# EAGLE design H03R00 (EAGLE 9.3.0)
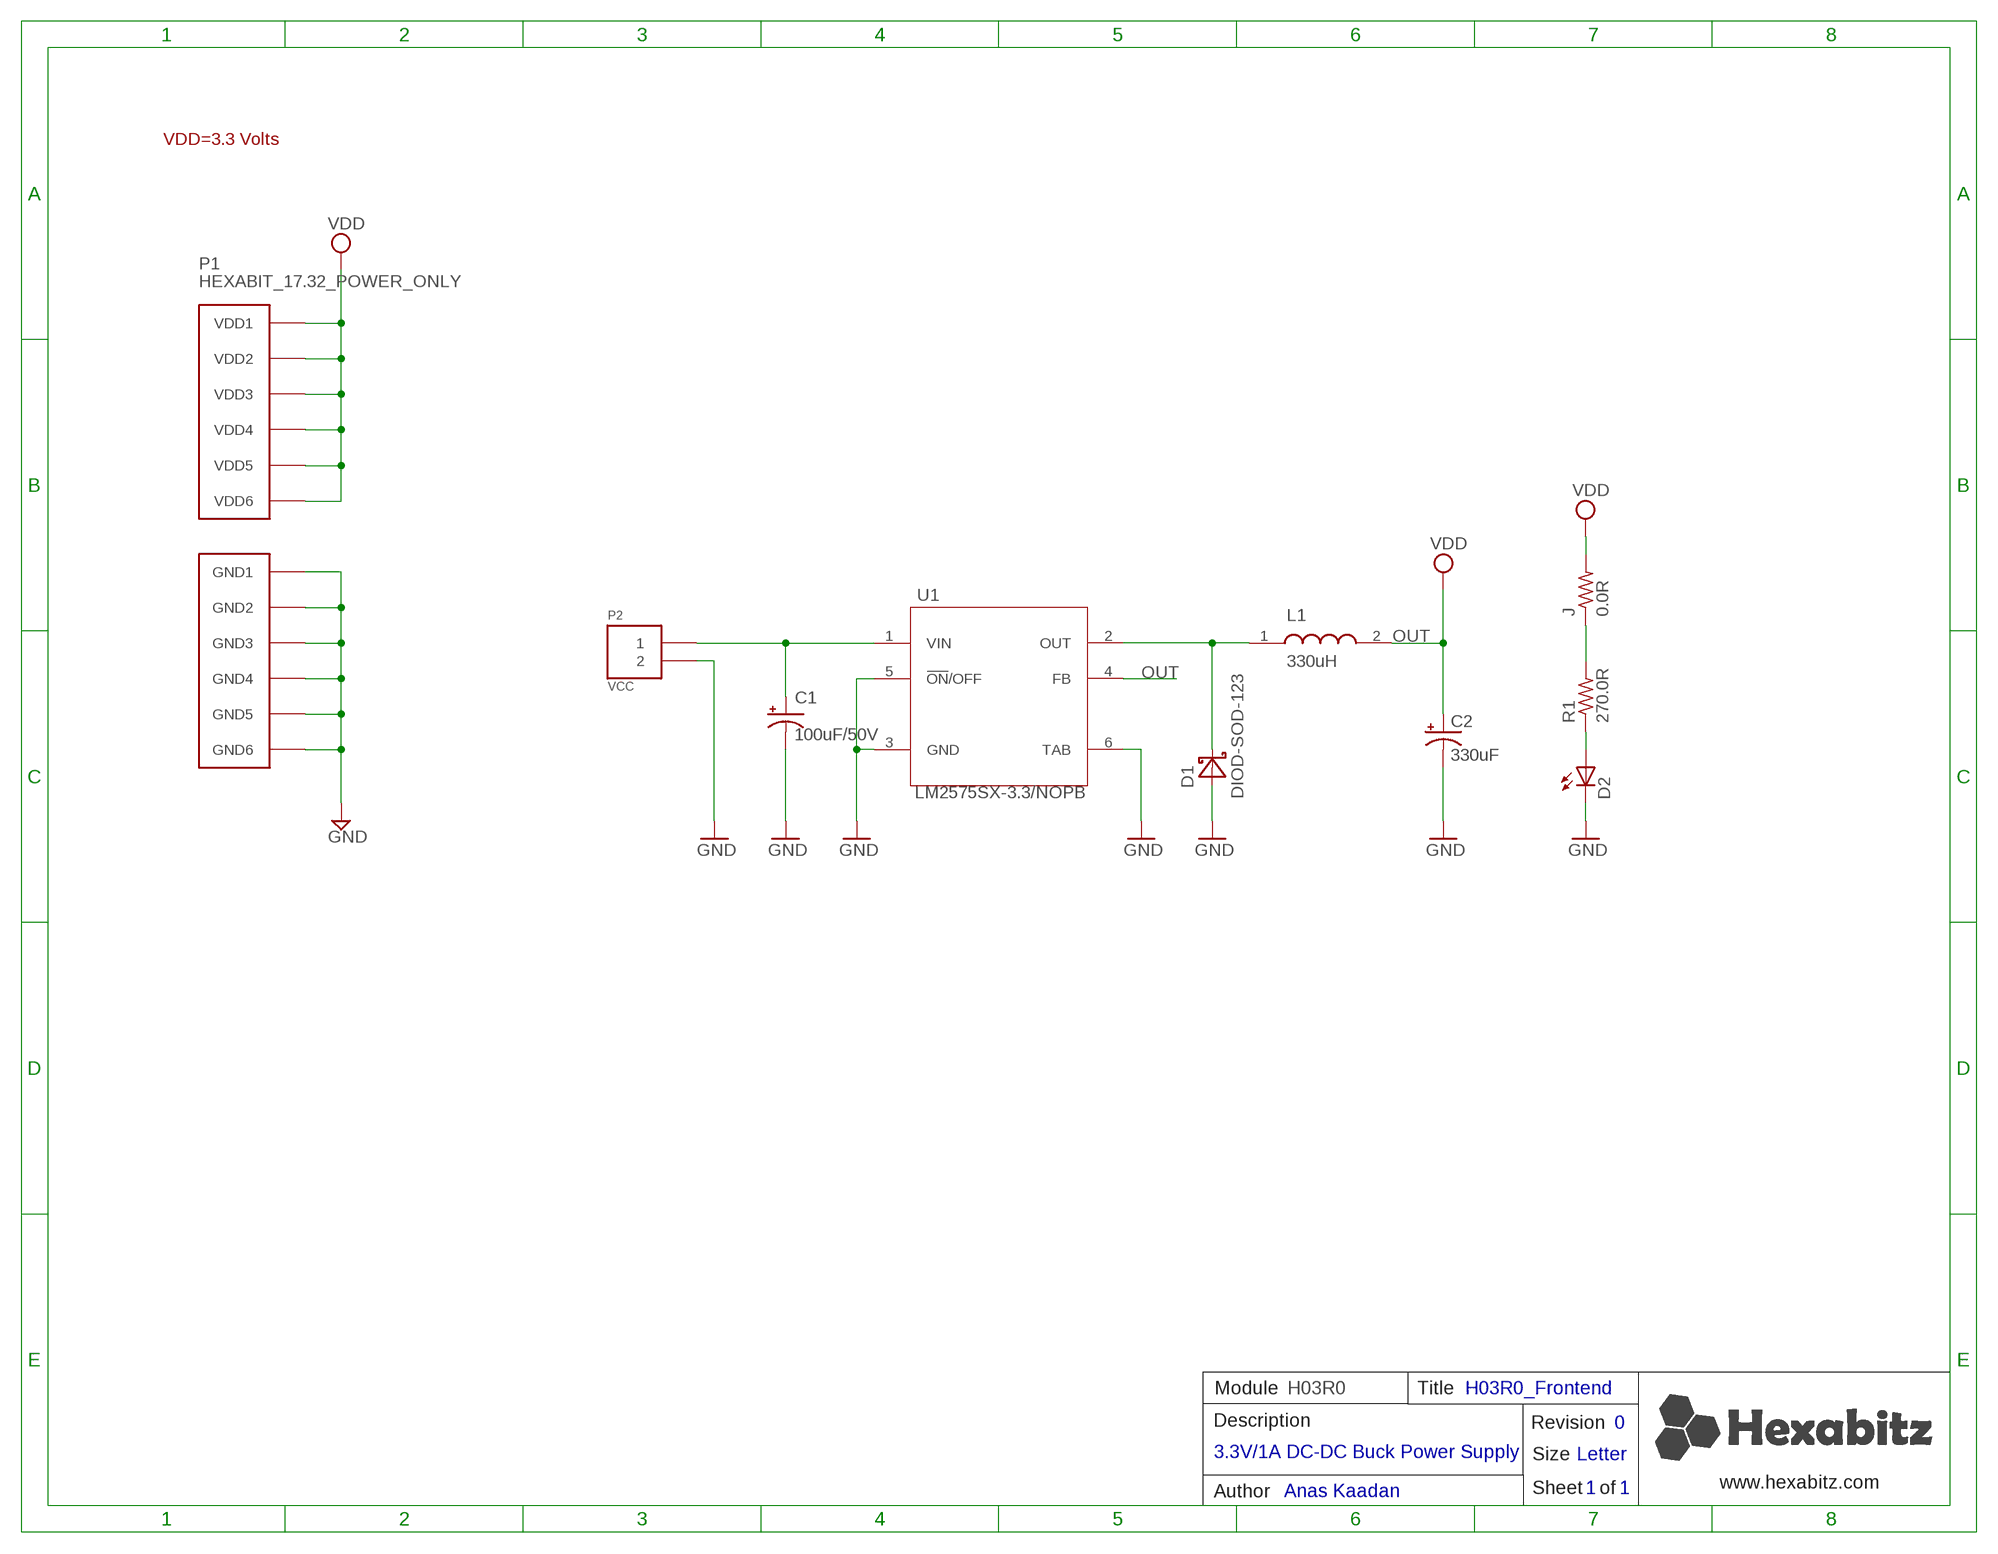
[diagram p0: schematic, sheet 1]

## Parts
C1  100uF/50V  CPOL-US  [E3,5-8]
C2  330uF  AVX-E  [CAPPM7343X200N]
D1  DIOD-SOD-123  [SOD123]
D2  VLMS1300-GS08  [VLMS1300-GS08]
J  0.0R  R-0603  [R-0603]
L1  330uH  SRR1280-331K  [SRR1280-150M]
P1  HEXABIT_17.32_POWER_ONLY  [HEXABIT_17.32_POWER_ONLY]
P2  VCC  1546111-2  [1546111-2]
R1  270.0R  R-0603  [R-0603]
U1  LM2575SX-3.3/NOPB  [TO170P1435X457-6N]

## Nets
GND: C1.- C2.2(-) D1.1(A) D2.C P1.PAD_PD7(GND1) P1.PAD_PD8(GND2) P1.PAD_PD9(GND3) P1.PAD_PD10(GND4) P1.PAD_PD11(GND5) P1.PAD_PD12(GND6) P2.2 U1.3(GND) U1.5(ON/OFF) U1.6(TAB)
N$1: C1.+ P2.1 U1.1(VIN)
N$2: D1.2(C) L1.1 U1.2(OUT)
N$3: D2.A R1.1
N$4: J.1 R1.2
OUT: C2.1(+) L1.2 U1.4(FB) ; supply symbol labelled VDD
VDD: J.2 P1.PAD_PU7(VDD1) P1.PAD_PU8(VDD2) P1.PAD_PU9(VDD3) P1.PAD_PU10(VDD4) P1.PAD_PU11(VDD5) P1.PAD_PU12(VDD6)

## Notes on the sheet
- VDD=3.3 Volts
- Module | H03R0 | Title | H03R0_Frontend
- Description | Revision | 0
- 3.3V/1A DC-DC Buck Power Supply | Size | Letter
- www.hexabitz.com
- Author | Anas Kaadan | Sheet   of | 1 | 1
- C:/Users/Admin/Desktop/logodraft.bmp | C:/Users/Admin/Desktop/logodraft.bmp

## Library data of the parts
C1 = Hexabitz:CPOL-US: ELECTROLYTIC CAPACITOR grid 3.5 mm, diameter 8 mm; CAPACITANCE: 100F; CPACITANCE_RATING: ±20%; MFN: Nichicon; MPN: UVR1H101MPD1TD; OCTOPART_ID: 913e58b97f3b4ef9; OCTOPART_URL: http://octopart.com/uvr1h101mpd1td-nichicon-9292643; VOLTAGE_RATING_DC: 50.0 V
C2 = Hexabitz:AVX-E: Panasonic 330F SMD Solid Polymer Tantalum Capacitor, 6.3 V 20%, POSCAP Series Source: Datasheet <https://industrial.panasonic.com/cdbs/www-data/pdf/AAA8000/AAA8000C68.pdf>; DESCRIPTION: Panasonic 330F SMD Solid Polymer Tantalum Capacitor, 6.3 V 20%, POSCAP Series; HEIGHT: 2mm; MANUFACTURER_NAME: Panasonic; MANUFACTURER_PART_NUMBER: 6TPC330MA; MOUSER_PART_NUMBER: 667-6TPC330MA; MOUSER_PRICE-STOCK: https://www.mouser.com/Search/Refine.aspx?Keyword=667-6TPC330MA; RS_PART_NUMBER: 1666900; RS_PRICE-STOCK: http://uk.rs-online.com/web/p/products/1666900
D1 = Hexabitz:DIOD-SOD-123: 1.0 A Surface Mount Schottky Barrier Rectifier, 40 V, -65 to 125 degC, 2-Pin SOD-123 Package, RoHS, Tape and Reel; CAPACITANCE: 1.1e-10 F; CURRENT_RATING: 1.0 A; MFN: diodes; MPN: 1N5819HW-7-F; OCTOPART_ID: e83e2130232537f9; OCTOPART_URL: https://octopart.com/1n5819hw-7-f-diodes+inc.-323197; VOLTAGE_RATING_DC: 40.0 V
D2 = Hexabitz:VLMS1300-GS08: Red 0603 130° Clear 54 mcd 2 V Surface Mount ChipLED ; Octopart Url : http://octopart.com/vlms1300-gs08-vishay-21709201; MFN: Vishay; MPN: VLMTG1300-GS08; OCTOPART_URL: http://octopart.com/vlmtg1300-gs08-vishay-21709202
J = Hexabitz:R-0603: Thick Film Resistors - SMD 0603; MFN: Yageo; MPN: RC0603JR-070RL; OCTOPART_URL: https://octopart.com/crcw06030000z0eahp-vishay-44320230; RESISTANCE: 0.0 Ω
L1 = Hexabitz:SRR1280-331K: Bourns SRR1280 Series Shielded Wire-wound SMD Inductor with a Ferrite Core, 330 H 10% Wire-Wound 1.1A Idc Q:18 Source: Datasheet <https://www.bourns.com/docs/Product-Datasheets/SRR1280.pdf>; ALLIED_NUMBER: 70277079; ALLIED_PRICE-STOCK: https://www.alliedelec.com/bourns-srr1280-331k/70277079/; DESCRIPTION: Bourns SRR1280 Series Shielded Wire-wound SMD Inductor with a Ferrite Core, 330 H 10% Wire-Wound 1.1A Idc Q:18; HEIGHT: mm; MANUFACTURER_NAME: Bourns; MANUFACTURER_PART_NUMBER: SRR1280-331K; MOUSER_PART_NUMBER: 652-SRR1280-331K; MOUSER_PRICE-STOCK: https://www.mouser.com/Search/Refine.aspx?Keyword=652-SRR1280-331K; RS_PART_NUMBER: 1728540; RS_PRICE-STOCK: http://uk.rs-online.com/web/p/products/1728540
P1 = hexabitz_connectors:HEXABIT_?_POWER_ONLY: Hexabitz Hexagon Module Connector Hexagon side length = 17.32mm. Power-only connector. All array ports are removed.
P2 = Hexabitz:1546111-2: Conn Shrouded Header HDR 2 POS 5.08mm Solder ST Thru-Hole; MFN: TE Connectivity; MPN: 1546111-2; OCTOPART_URL: https://octopart.com/1546111-2-te+connectivity-40393355
R1 = Hexabitz:R-0603: Thick Film Resistors - SMD 0603; MFN: Yageo; MPN: RC0603FR-07270RL; OCTOPART_URL: https://octopart.com/crcw0603270rjnea-vishay-39784736; RESISTANCE: 270.0 Ω; TOLERANCE: ±5%
U1 = Hexabitz:LM2575SX-3.3/NOPB: Step-Down Voltage Regulator; DESCRIPTION: Conv DC-DC 4V to 40V Step Down Single-Out 3.3V 1A 6-Pin_5+Tab_ TO-263 T/R; DIGI-KEY_PART_NUMBER: LM2575SX-3.3/NOPBCT-ND; DIGI-KEY_PURCHASE_URL: https://www.digikey.com/product-detail/en/texas-instruments/LM2575SX-3.3-NOPB/LM2575SX-3.3-NOPBCT-ND/3526855?utm_source=snapeda&utm_medium=aggregator&utm_campaign=symbol; MF: Texas Instruments; MP: LM2575SX-3.3/NOPB; PACKAGE: TO-263-6 Texas Instruments

## Board
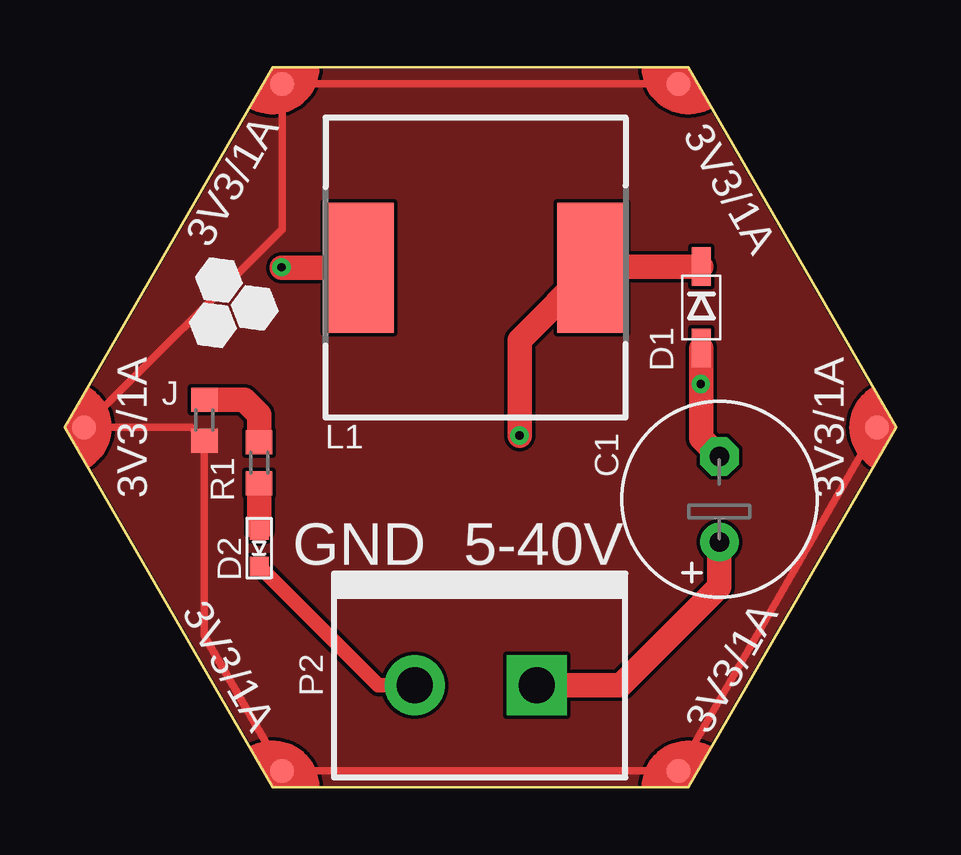
[diagram p1: board, top side]
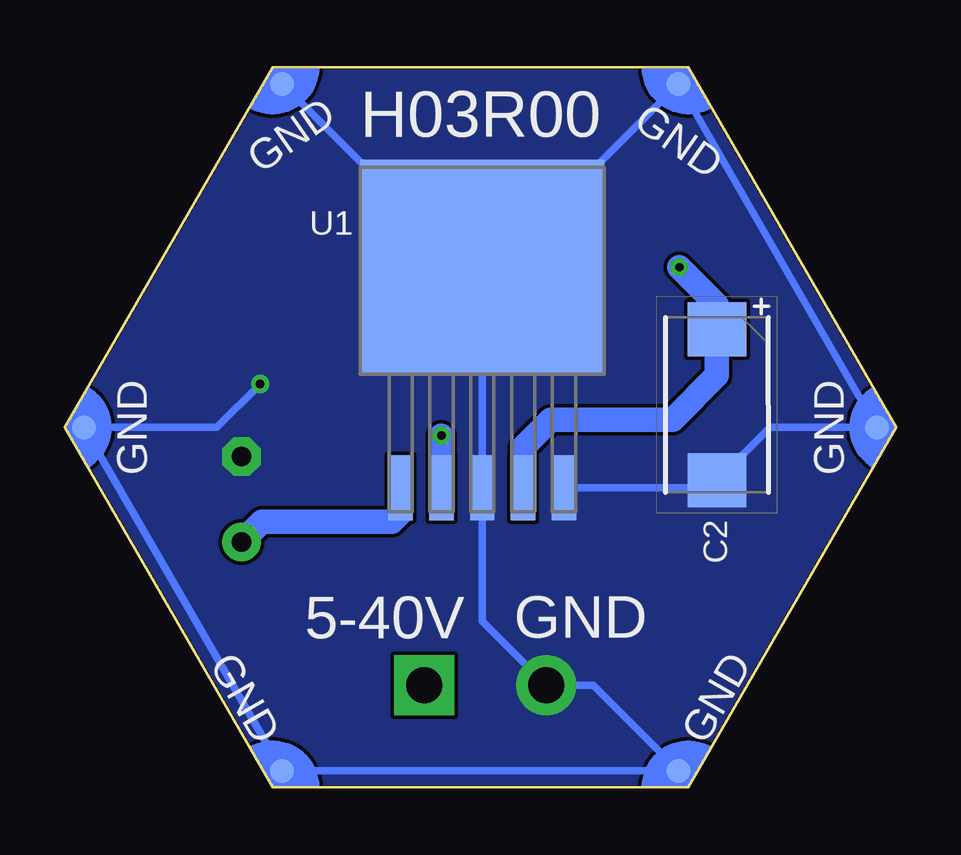
[diagram p2: board, bottom side, seen from below]

Size 34.64 x 30 mm. Coordinates in mm from the lower left corner, seen from the top.
Copper layers (1*16): Top 0.035mm / dielectric 1.5mm / Bottom 0.035mm
Design rules "2_layer": minimum track width 7mil, minimum drill 10mil, track to track 6mil, track to pad 6mil, pad to pad 6mil, via to via 6mil, smd to smd 0mil, copper to edge 1mil, drill to drill 8mil, minimum pad ring 10mil, minimum via ring 8mil, stop-mask expansion 2mil, vias tented up to drill 15mil, thermal gap 10mil

### Footprints (pad centres in the part's own frame; a part is rotated, then mirrored left to right if it is on the bottom)
E3,5-8 = drill 0.813 pad 1.6: + -1.778,0 | drill 0.813 pad 1.6 octagon: - 1.778,0
CAPPM7343X200N = smd 2.25 x 2.45: 1 -3.15,0; 2 3.15,0
SOD123 = smd 1.6 x 0.8: 1 -1.7,0; 2 1.7,0
VLMS1300-GS08 = smd 0.8 x 0.8: A 0,0.75; C 0,-0.75
R-0603 = smd 1 x 1.1: 1 -0.85,0; 2 0.85,0
SRR1280-150M = smd 2.9 x 5.4: 1 -4.85,0; 2 4.85,0
HEXABIT_17.32_POWER_ONLY = smd 1 x 1 bottom: PAD_PD7 8.26,14.31; PAD_PD8 16.52,0; PAD_PD9 8.26,-14.31; PAD_PD10 -8.26,-14.31; PAD_PD11 -16.52,0; PAD_PD12 -8.26,14.31 | smd 1 x 1: PAD_PU7 8.26,14.31; PAD_PU8 16.52,0; PAD_PU9 8.26,-14.31; PAD_PU10 -8.26,-14.31; PAD_PU11 -16.52,0; PAD_PU12 -8.26,14.31
1546111-2 = drill 1.5 pad 2.5 square: 1 -2.54,0 | drill 1.5 pad 2.5: 2 2.54,0
TO170P1435X457-6N = smd 1.016 x 2.692: 1 -3.404,-9.042; 2 -1.702,-9.042; 3 0,-9.042; 4 1.702,-9.042; 5 3.404,-9.042 | smd 10.16 x 8.941: 6 0,0.152

### Placement (x,y rotation side)
C1  27.28,12 90 top
C2  7.46,15.94 270 bottom
D1  26.51,20 90 top
D2  8.1,9.97 0 top
J  5.81,15.3 270 top
L1  17.12,21.65 180 top
P1  17.32,15 0 top
P2  17.12,4.26 180 top
R1  8.1,13.53 90 top
U1  17.24,21.53 0 bottom

### Tracks (layer width: path | path; a pad name or v marks a point on that pad's centre or on a via)
GND  (via drill 0.35)
  Top 0.305: D1.1 26.51,16.82 v26.5,16.81
  Top 0.61: D2.C 13.06,4.26 P2.2
  Top 1.016: C1.- 26.51,14.54 D1.1
  Bottom 0.305: v26.5,16.81 28.31,15 P1.PAD_PD8 P1.PAD_PD9 P1.PAD_PD10 12.63,4.26 P2.2 17.24,6.92 U1.3 U1.6 | U1.5 7.77,12.49 C2.2 5.25,15 P1.PAD_PD11 P1.PAD_PD12 16.69,21.68 U1.6 | P1.PAD_PD7 17.95,21.68 U1.6
  pour Bottom (no thermals): 8.66,0 25.98,0 34.64,15 25.98,30 8.66,30 0,15
N$1
  Top 0.305: 27.26,10.21 C1.+
  Top 1.016: P2.1 23.16,4.26 27.26,8.36 27.26,10.21
  Bottom 1.016: C1.+ 26.43,11.07 21.02,11.07 20.66,11.43 20.66,12.47 U1.1
N$2  (via drill 0.35)
  Top 0.305: 22.02,21.7 L1.1
  Top 1.016: D1.2 22.02,21.7 | L1.1 18.95,18.64 v18.95,14.66
  Bottom 0.305: U1.2
  Bottom 1.016: v18.95,14.66 U1.2
N$3
  Top 1.016: D2.A R1.1
N$4
  Top 0.305: 7.47,16.16 7.47,16.15
  Top 1.016: R1.2 8.1,15.53 7.47,16.16 | 7.47,16.15 J.1
OUT  (via drill 0.35)
  Top 0.305: v9.03,21.67 9.05,21.65
  Top 1.016: 9.05,21.65 L1.2
  Bottom 1.016: v9.03,21.67 7.46,20.11 C2.1 7.46,17.18 9.31,15.33 14.39,15.33 15.54,14.18 U1.4
VDD
  Top 0.305: P1.PAD_PU7 P1.PAD_PU12 9.06,23.26 P1.PAD_PU11 5.27,15 J.2 5.81,6.31 P1.PAD_PU10 P1.PAD_PU9 P1.PAD_PU8
  pour Top (no thermals): 8.66,0 25.98,0 34.64,15 25.98,30 8.66,30 0,15

### Text on the board
tPlace: 3V3/1A | 3V3/1A | 3V3/1A | 3V3/1A | GND | 5-40V | 3V3/1A | 3V3/1A
bPlace: H03R00 | GND | GND | GND | GND | GND | 5-40V | GND | GND